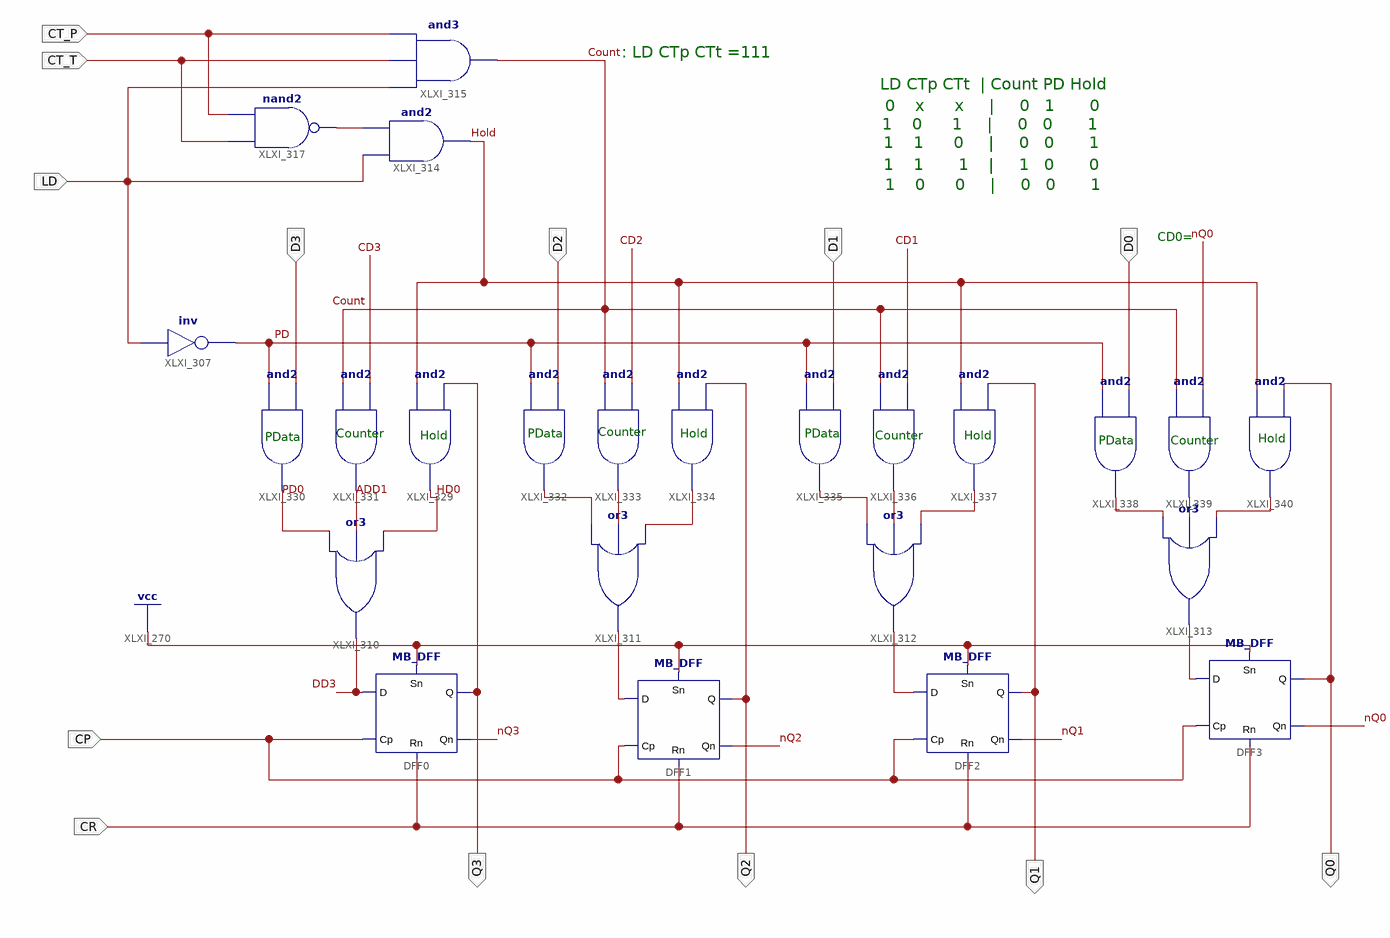
[diagram p0: schematic sheet 1]
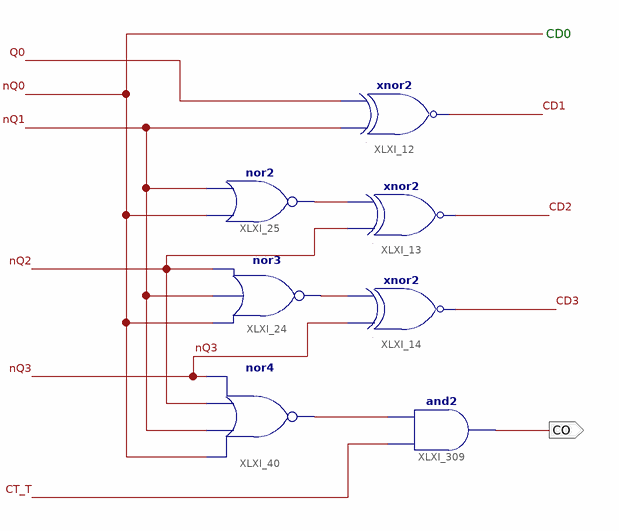
[diagram p1: schematic sheet 2]
// Xilinx ISE schematic CT74LS161.sch (kintex7) as structural Verilog: 31 symbols, 14 ports
module CT74LS161 (
  input  CR,
  input  D3,
  input  D2,
  input  D1,
  input  CP,
  input  CT_T,
  input  CT_P,
  input  LD,
  input  D0,
  output Q3,
  output Q2,
  output Q1,
  output Q0,
  output CO
);

  wire ADD1, CD1, CD2, CD3, Count, DD3, HD0, Hold, nQ0, nQ1, nQ2, nQ3, PD, PD0, XLXN_2, XLXN_4, XLXN_44,
       XLXN_45, XLXN_46, XLXN_93, XLXN_94, XLXN_95, XLXN_107, XLXN_109, XLXN_183, XLXN_186, XLXN_628,
       XLXN_818, XLXN_912, XLXN_921;

  MB_DFF DFF1 (.Cp(CP), .D(XLXN_2), .Qn(nQ2), .Q(Q2), .Sn(1'b1), .Rn(CR));
  MB_DFF DFF2 (.Cp(CP), .D(XLXN_921), .Qn(nQ1), .Q(Q1), .Sn(1'b1), .Rn(CR));
  MB_DFF DFF0 (.Cp(CP), .D(DD3), .Qn(nQ3), .Q(Q3), .Sn(1'b1), .Rn(CR));
  MB_DFF DFF3 (.Cp(CP), .D(XLXN_4), .Qn(nQ0), .Q(Q0), .Sn(1'b1), .Rn(CR));
  xnor XLXI_12 (CD1, nQ1, Q0);
  xnor XLXI_13 (CD2, nQ2, XLXN_186);
  nor XLXI_25 (XLXN_186, nQ0, nQ1);
  xnor XLXI_14 (CD3, nQ3, XLXN_183);
  nor XLXI_24 (XLXN_183, nQ0, nQ1, nQ2);
  nor XLXI_40 (XLXN_628, nQ0, nQ1, nQ2, nQ3);
  and XLXI_309 (CO, CT_T, XLXN_628);
  or XLXI_310 (DD3, PD0, ADD1, HD0);
  or XLXI_311 (XLXN_2, XLXN_44, XLXN_45, XLXN_46);
  or XLXI_312 (XLXN_921, XLXN_93, XLXN_94, XLXN_95);
  or XLXI_313 (XLXN_4, XLXN_107, XLXN_912, XLXN_109);
  nand XLXI_317 (XLXN_818, CT_T, CT_P);
  not XLXI_307 (PD, LD);
  and XLXI_315 (Count, LD, CT_T, CT_P);
  and XLXI_314 (Hold, LD, XLXN_818);
  and XLXI_329 (HD0, Hold, Q3);
  and XLXI_330 (PD0, PD, D3);
  and XLXI_331 (ADD1, Count, CD3);
  and XLXI_332 (XLXN_44, PD, D2);
  and XLXI_333 (XLXN_45, Count, CD2);
  and XLXI_334 (XLXN_46, Hold, Q2);
  and XLXI_335 (XLXN_93, PD, D1);
  and XLXI_336 (XLXN_94, Count, CD1);
  and XLXI_337 (XLXN_95, Hold, Q1);
  and XLXI_338 (XLXN_107, PD, D0);
  and XLXI_339 (XLXN_912, Count, nQ0);
  and XLXI_340 (XLXN_109, Hold, Q0);

  // Notes on the sheet:
  //   : LD CTp CTt =111
  //   LD CTp CTt  | Count PD Hold
  //   0    x      x     |     0   1       0
  //   1    0      1     |     0   0       1
  //   1    1      0     |     0   0       1
  //   1    1       1    |     1   0       0
  //   1    0      0     |     0   0       1
  //   CD0=
  //   Counter
  //   Counter
  //   PData
  //   Hold
  //   PData
  //   Hold
  //   Counter
  //   Hold
  //   PData
  //   Hold
  //   PData
  //   Counter
  //   CD0
endmodule
